# EAGLE schematic main (EAGLE 9.6.2)
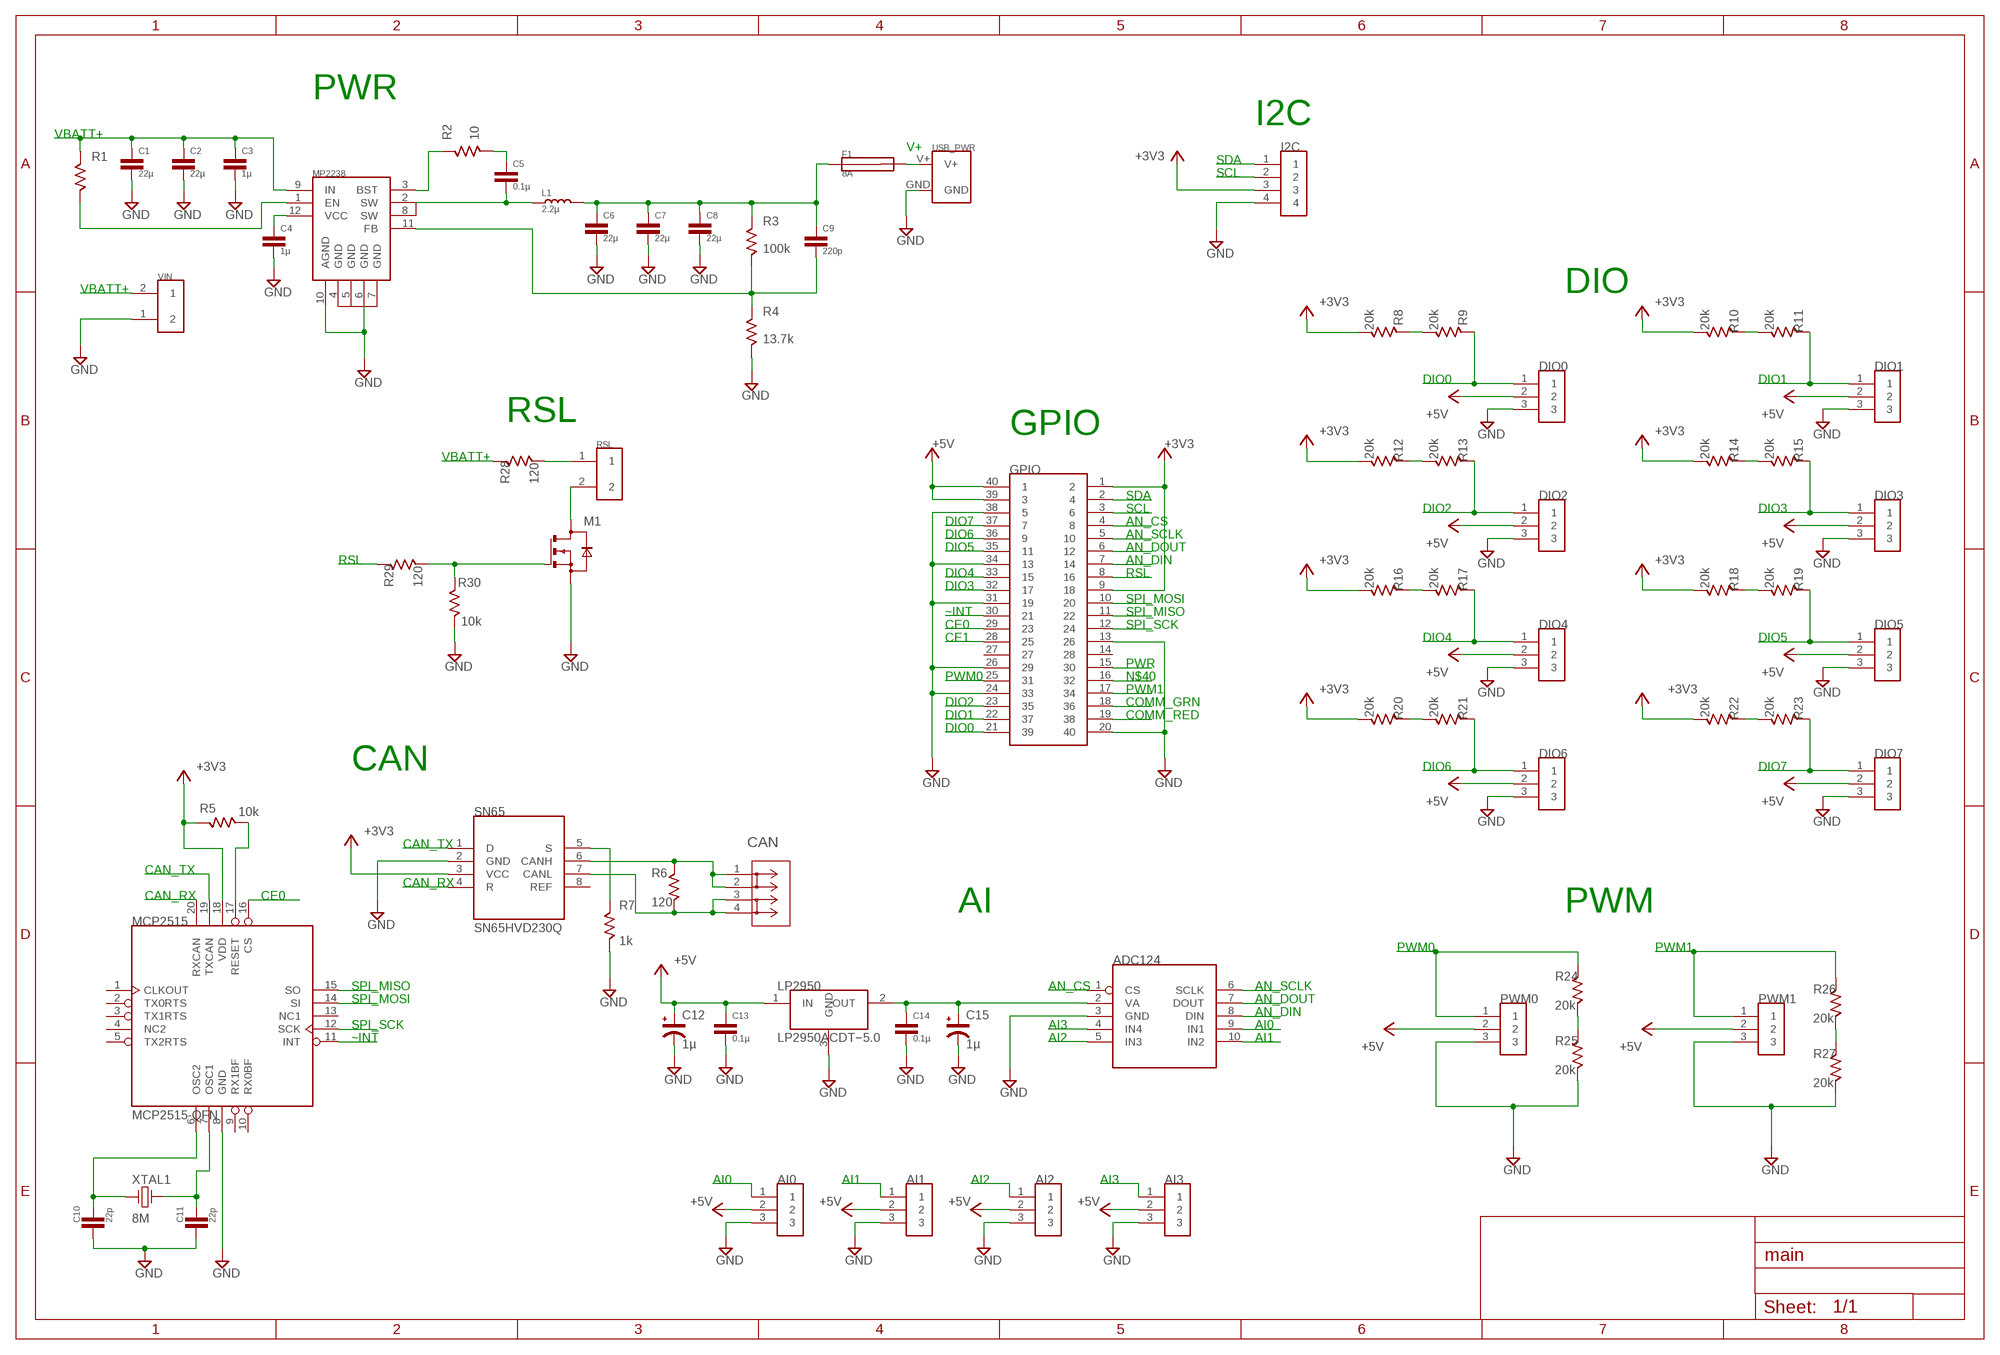
[diagram p0: schematic, sheet 1, part 1 of 2]
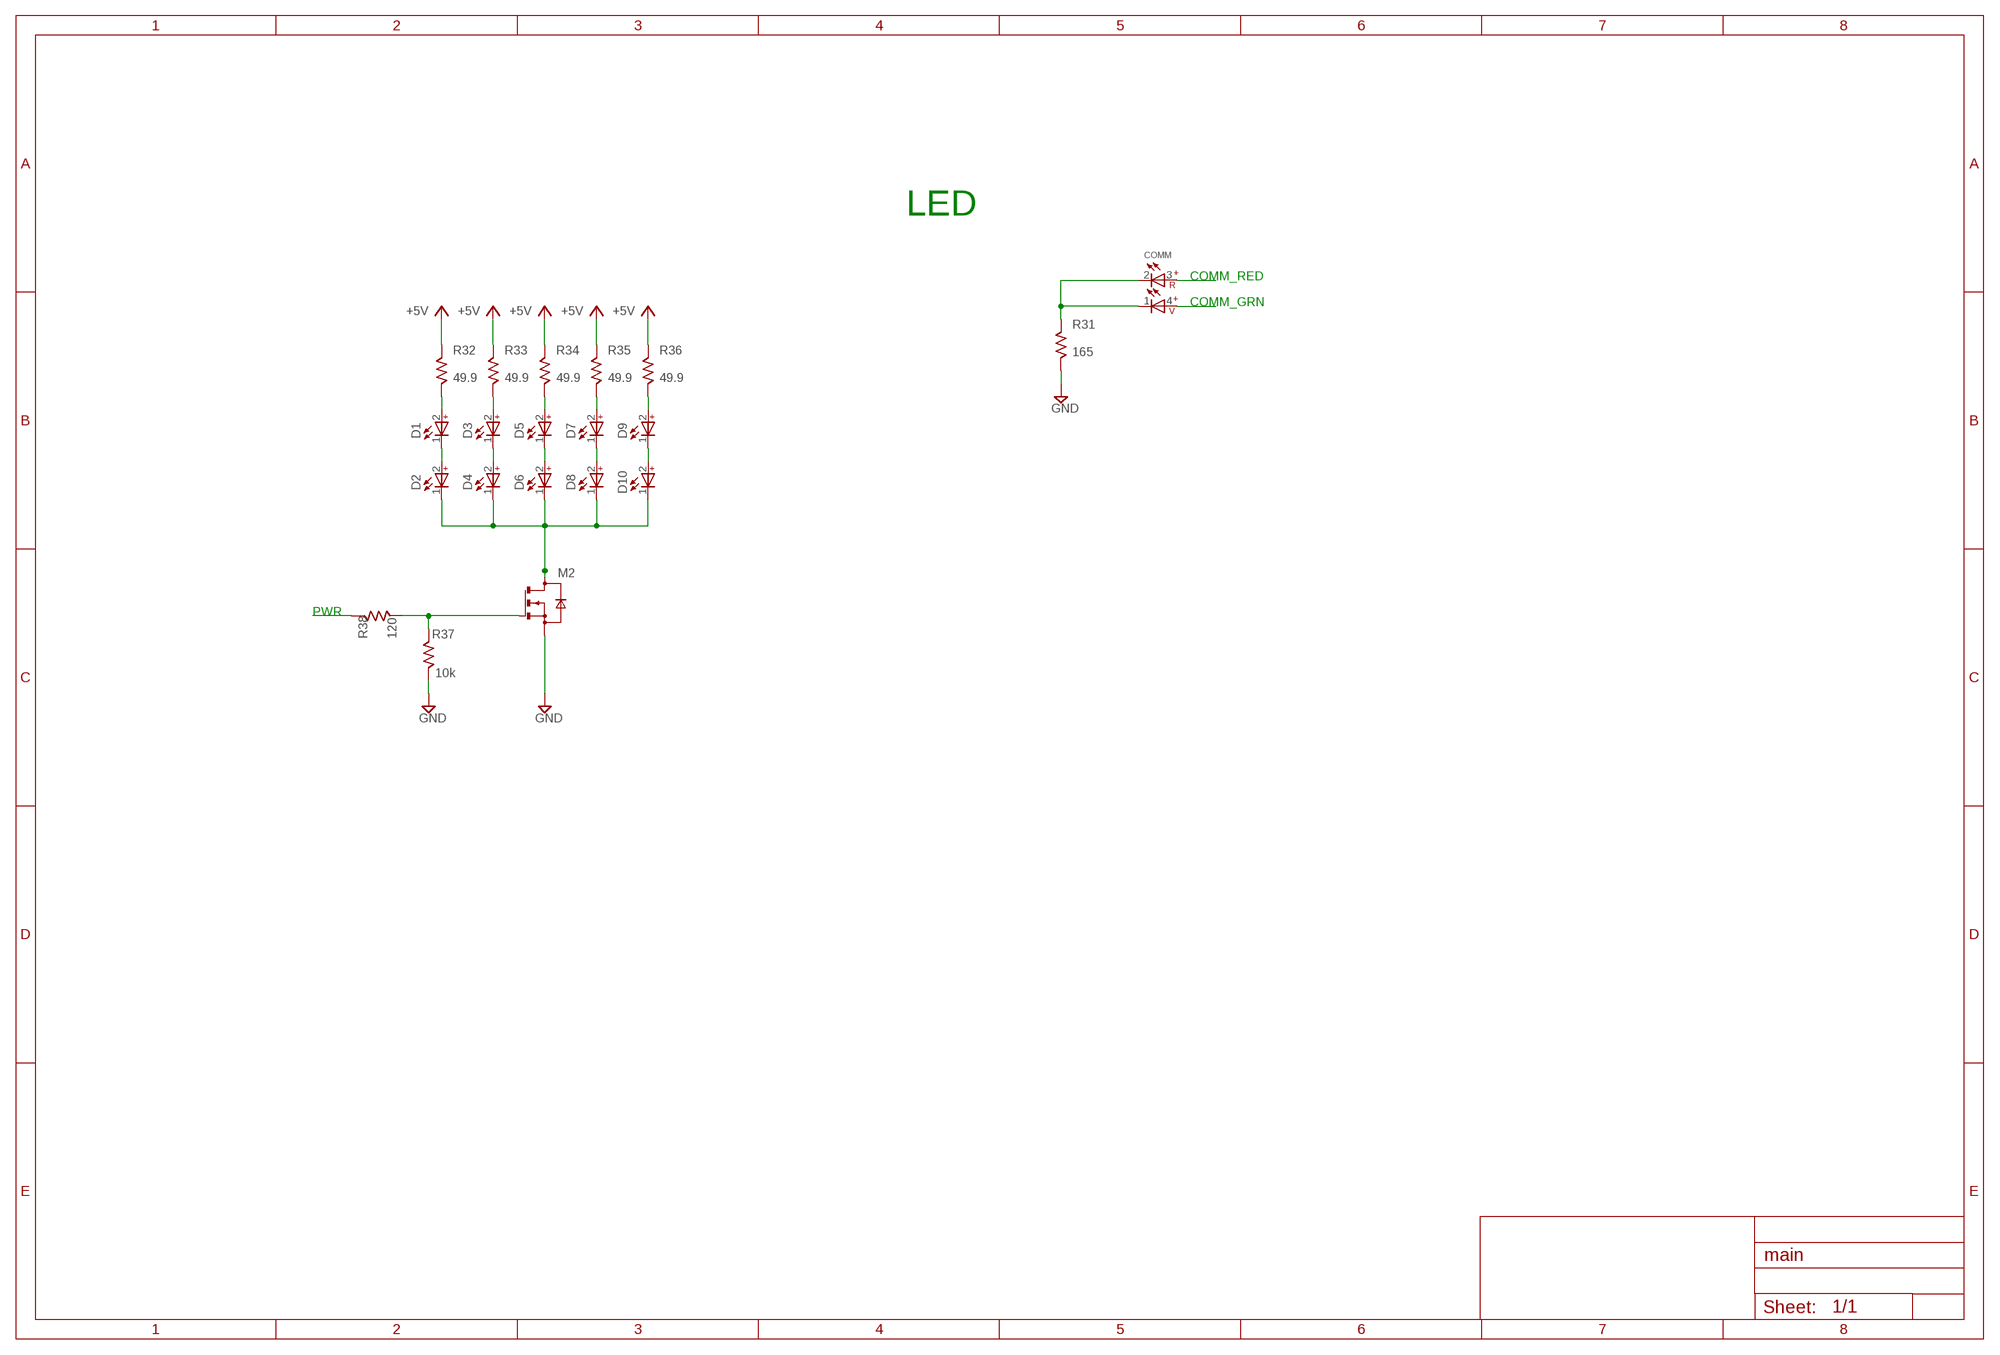
[diagram p1: schematic, sheet 1, part 2 of 2]

## Parts
ADC124  ADC124S051  [SOP50P490X110-10N]
AI0  3X1_MALE_HEADER_PIN  [HDRV3W64P254_1X3_762X254X838B]
AI1  3X1_MALE_HEADER_PIN  [HDRV3W64P254_1X3_762X254X838B]
AI2  3X1_MALE_HEADER_PIN  [HDRV3W64P254_1X3_762X254X838B]
AI3  3X1_MALE_HEADER_PIN  [HDRV3W64P254_1X3_762X254X838B]
C1  22µ  0805_CAPACITOR  [CAPC1912X140N]
C2  22µ  0805_CAPACITOR  [CAPC1912X140N]
C3  1µ  0603_CAPACITOR  [CAPC1608X90N]
C4  1µ  0603_CAPACITOR  [CAPC1608X90N]
C5  0.1µ  0603_CAPACITOR  [CAPC1608X90N]
C6  22µ  0805_CAPACITOR  [CAPC1912X140N]
C7  22µ  0805_CAPACITOR  [CAPC1912X140N]
C8  22µ  0805_CAPACITOR  [CAPC1912X140N]
C9  220p  0603_CAPACITOR  [CAPC1608X90N]
C10  22p  0402_CAPACITOR  [CAPC4020X56N]
C11  22p  0402_CAPACITOR  [CAPC4020X56N]
C12  1µ  1206_POL_TANT_CAP  [CAPMP3216X180N]
C13  0.1µ  0603_CAPACITOR  [CAPC1608X90N]
C14  0.1µ  0603_CAPACITOR  [CAPC1608X90N]
C15  1µ  1206_POL_TANT_CAP  [CAPMP3216X180N]
CAN  1870640000  [CONN_1870640000_WED]
COMM  WL-SBCC_0603_150060RV75240  [WL-SBCC_0603]
D1  WL-SMCD_0603_150060VS55040  [WL-SMCD_0603]
D2  WL-SMCD_0603_150060VS55040  [WL-SMCD_0603]
D3  WL-SMCD_0603_150060VS55040  [WL-SMCD_0603]
D4  WL-SMCD_0603_150060VS55040  [WL-SMCD_0603]
D5  WL-SMCD_0603_150060VS55040  [WL-SMCD_0603]
D6  WL-SMCD_0603_150060VS55040  [WL-SMCD_0603]
D7  WL-SMCD_0603_150060VS55040  [WL-SMCD_0603]
D8  WL-SMCD_0603_150060VS55040  [WL-SMCD_0603]
D9  WL-SMCD_0603_150060VS55040  [WL-SMCD_0603]
D10  WL-SMCD_0603_150060VS55040  [WL-SMCD_0603]
DIO0  3X1_MALE_HEADER_PIN  [HDRV3W64P254_1X3_762X254X838B]
DIO1  3X1_MALE_HEADER_PIN  [HDRV3W64P254_1X3_762X254X838B]
DIO2  3X1_MALE_HEADER_PIN  [HDRV3W64P254_1X3_762X254X838B]
DIO3  3X1_MALE_HEADER_PIN  [HDRV3W64P254_1X3_762X254X838B]
DIO4  3X1_MALE_HEADER_PIN  [HDRV3W64P254_1X3_762X254X838B]
DIO5  3X1_MALE_HEADER_PIN  [HDRV3W64P254_1X3_762X254X838B]
DIO6  3X1_MALE_HEADER_PIN  [HDRV3W64P254_1X3_762X254X838B]
DIO7  3X1_MALE_HEADER_PIN  [HDRV3W64P254_1X3_762X254X838B]
F1  8A  1206_FUSE  [FUSC3216X117N]
GPIO  2X20_FEMALE_HEADER_PINV1  [HDRVR40W64P254_2X20_5080X508X850B]
I2C  4X1_MALE_HEADER_PIN4X1_MALE_HEADER_PIN  [HDRV4W64P254_1X4_1016X254X838B]
L1  2.2µ  ECS-MPIL0630-2R2MC  [INDM7166X300N]
LP2950  LP2950ACDT−5.0  [TO229P990X238-3N]
M1  MOSFET  [SOT95P240X100-3N]
M2  MOSFET  [SOT95P240X100-3N]
MCP2515  MCP2515-QFN  [QFN50P400X400X90-21T270N]
MP2238  MP2238  [MP2238]
PWM0  3X1_MALE_HEADER_PIN  [HDRV3W64P254_1X3_762X254X838B]
PWM1  3X1_MALE_HEADER_PIN  [HDRV3W64P254_1X3_762X254X838B]
R1  0603_RESISTOR  [RESC1508X45N]
R2  10  0603_RESISTOR  [RESC1508X45N]
R3  100k  0603_RESISTOR  [RESC1508X45N]
R4  13.7k  0603_RESISTOR  [RESC1508X45N]
R5  10k  1206_RESISTOR  [RESC3116X55N]
R6  120  0603_RESISTOR  [RESC1508X45N]
R7  1k  1206_RESISTOR  [RESC3116X55N]
R8  20k  0805_RESISTOR  [RESC2012X45N]
R9  20k  0805_RESISTOR  [RESC2012X45N]
R10  20k  0805_RESISTOR  [RESC2012X45N]
R11  20k  0805_RESISTOR  [RESC2012X45N]
R12  20k  0805_RESISTOR  [RESC2012X45N]
R13  20k  0805_RESISTOR  [RESC2012X45N]
R14  20k  0805_RESISTOR  [RESC2012X45N]
R15  20k  0805_RESISTOR  [RESC2012X45N]
R16  20k  0805_RESISTOR  [RESC2012X45N]
R17  20k  0805_RESISTOR  [RESC2012X45N]
R18  20k  0805_RESISTOR  [RESC2012X45N]
R19  20k  0805_RESISTOR  [RESC2012X45N]
R20  20k  0805_RESISTOR  [RESC2012X45N]
R21  20k  0805_RESISTOR  [RESC2012X45N]
R22  20k  0805_RESISTOR  [RESC2012X45N]
R23  20k  0805_RESISTOR  [RESC2012X45N]
R24  20k  0805_RESISTOR  [RESC2012X45N]
R25  20k  0805_RESISTOR  [RESC2012X45N]
R26  20k  0805_RESISTOR  [RESC2012X45N]
R27  20k  0805_RESISTOR  [RESC2012X45N]
R28  120  0603_RESISTOR  [RESC1508X45N]
R29  120  0603_RESISTOR  [RESC1508X45N]
R30  10k  1206_RESISTOR  [RESC3116X55N]
R31  165  0805_RESISTOR  [RESC2012X45N]
R32  49.9  0603_RESISTOR  [RESC1508X45N]
R33  49.9  0603_RESISTOR  [RESC1508X45N]
R34  49.9  0603_RESISTOR  [RESC1508X45N]
R35  49.9  0603_RESISTOR  [RESC1508X45N]
R36  49.9  0603_RESISTOR  [RESC1508X45N]
R37  10k  1206_RESISTOR  [RESC3116X55N]
R38  120  0603_RESISTOR  [RESC1508X45N]
RSL  2X1_MALE_HEADER_PIN  [HDRV2W64P254_1X2_508X254X838B]
SN65  SN65HVD230Q  [SOIC127P599X175-8N]
USB_PWR  USB-C_POWER_PAD  [USB-C_POWER_PAD]
VIN  CTF020V8  [CTF020V8]
XTAL1  8M  CRYSTAL  [XTALRR488W60L1150T500H350B]

## Nets
+3V3: GPIO.1 GPIO.9 I2C.3 MCP2515.18(VDD) R5.1 R8.1 R10.1 R12.1 R14.1 R16.1 R18.1 R20.1 R22.1 SN65.3(VCC)
+5V: AI0.2 AI1.2 AI2.2 AI3.2 C12.1 C13.1(L1) DIO0.2 DIO1.2 DIO2.2 DIO3.2 DIO4.2 DIO5.2 DIO6.2 DIO7.2 GPIO.39 GPIO.40 LP2950.1(IN) PWM0.2 PWM1.2 R32.2 R33.2 R34.2 R35.2 R36.2
AI0: ADC124.9(IN1) AI0.1
AI1: ADC124.10(IN2) AI1.1
AI2: ADC124.5(IN3) AI2.1
AI3: ADC124.4(IN4) AI3.1
AN_CS: ADC124.1(CS) GPIO.4
AN_DIN: ADC124.8(DIN) GPIO.7
AN_DOUT: ADC124.7(DOUT) GPIO.6
AN_SCLK: ADC124.6(SCLK) GPIO.5
CAN_RX: MCP2515.20(RXCAN) SN65.4(R)
CAN_TX: MCP2515.19(TXCAN) SN65.1(D)
CE0: GPIO.29 MCP2515.16(CS)
CE1: GPIO.28
COMM_GRN: COMM.4(V+) GPIO.18
COMM_RED: COMM.3(R+) GPIO.19
DIO0: DIO0.1 GPIO.21 R9.2
DIO1: DIO1.1 GPIO.22 R11.2
DIO2: DIO2.1 GPIO.23 R13.2
DIO3: DIO3.1 GPIO.32 R15.2
DIO4: DIO4.1 GPIO.33 R17.2
DIO5: DIO5.1 GPIO.35 R19.2
DIO6: DIO6.1 GPIO.36 R21.2
DIO7: DIO7.1 GPIO.37 R23.2
GND: ADC124.3(GND) AI0.3 AI1.3 AI2.3 AI3.3 C1.2(L2) C2.2(L2) C3.2(L2) C4.2(L2) C6.2(L2) C7.2(L2) C8.2(L2) C10.2(L1) C11.2(L1) C12.2 C13.2(L2) C14.2(L2) C15.2 DIO0.3 DIO1.3 DIO2.3 DIO3.3 DIO4.3 DIO5.3 DIO6.3 DIO7.3 GPIO.13 GPIO.20 GPIO.24 GPIO.26 GPIO.31 GPIO.34 GPIO.38 I2C.4 LP2950.3(GND) M1.2 M2.2 MCP2515.8(GND) MP2238.6(GND) MP2238.10(AGND) PWM0.3 PWM1.3 R4.1 R7.2 R25.1 R27.1 R30.1 R31.1 R37.1 SN65.2(GND) USB_PWR.GND VIN.1
N$1: M1.3 R29.1 R30.2
N$2: C4.1(L1) MP2238.12(VCC)
N$3: MP2238.3(BST) R2.2
N$4: MP2238.1(EN) R1.1
N$5: D1.1(_) D2.2(+)
N$6: R8.2 R9.1
N$7: D1.2(+) R32.1
N$8: D3.1(_) D4.2(+)
N$9: D3.2(+) R33.1
N$10: D5.1(_) D6.2(+)
N$11: R12.2 R13.1
N$12: D5.2(+) R34.1
N$13: D7.1(_) D8.2(+)
N$14: R16.2 R17.1
N$15: R20.2 R21.1
N$16: R10.2 R11.1
N$17: R14.2 R15.1
N$18: D7.2(+) R35.1
N$19: D9.1(_) D10.2(+)
N$20: C10.1(L2) MCP2515.6(OSC2) XTAL1.1(L1)
N$21: R18.2 R19.1
N$22: D9.2(+) R36.1
N$23: M2.3 R37.2 R38.1
N$24: D2.1(_) D4.1(_) D6.1(_) D8.1(_) D10.1(_) M2.1
N$25: R22.2 R23.1
N$27: R24.1 R25.2
N$33: R26.1 R27.2
N$34: CAN.1 CAN.2 R6.2 SN65.6(CANH)
N$35: CAN.3 CAN.4 R6.1 SN65.7(CANL)
N$36: R7.1 SN65.5(S)
N$38: ADC124.2(VA) C14.1(L1) C15.1 LP2950.2(OUT)
N$40: GPIO.16
N$41: C11.1(L2) MCP2515.7(OSC1) XTAL1.2(L2)
N$45: C9.2(L2) MP2238.11(FB) R3.1 R4.2
N$47: C6.1(L1) C7.1(L1) C8.1(L1) C9.1(L1) F1.1 L1.2 R3.2
N$48: MCP2515.17(RESET) R5.2
N$49: C5.2(L2) L1.1 MP2238.2(SW)
N$50: C5.1(L1) R2.1
N$52: R28.1 RSL.1
N$53: M1.1 RSL.2
N$56: COMM.1(V-) COMM.2(R-) R31.2
PWM0: GPIO.25 PWM0.1 R24.2
PWM1: GPIO.17 PWM1.1 R26.2
PWR: GPIO.15 R38.2
RSL: GPIO.8 R29.2
SCL: GPIO.3 I2C.2
SDA: GPIO.2 I2C.1
SPI_MISO: GPIO.11 MCP2515.15(SO)
SPI_MOSI: GPIO.10 MCP2515.14(SI)
SPI_SCK: GPIO.12 MCP2515.12(SCK)
V+: F1.2 USB_PWR.V+
VBATT+: C1.1(L1) C2.1(L1) C3.1(L1) MP2238.9(IN) R1.2 R28.2 VIN.2
~INT: GPIO.30 MCP2515.11(INT)
Unconnected: GPIO.14 GPIO.27 MCP2515.1(CLKOUT) MCP2515.2(TX0RTS) MCP2515.3(TX1RTS) MCP2515.4(NC2) MCP2515.5(TX2RTS) MCP2515.9(RX1BF) MCP2515.10(RX0BF) MCP2515.13(NC1) MP2238.4(GND) MP2238.5(GND) MP2238.7(GND) MP2238.8(SW) SN65.8(REF)

## Notes on the sheet
- PWR
- I2C
- LED
- DIO
- RSL
- GPIO
- CAN
- AI | PWM

## Library data of the parts
ADC124 = SamuelLibrary:ADC124S051
AI0 AI1-AI3 DIO0 DIO1-DIO7 PWM0 PWM1 = SamuelLibrary:3X1_MALE_HEADER_PIN
C1 C2 C6-C8 = SamuelLibrary:0805_CAPACITOR
C3-C5 C9 C13 C14 = SamuelLibrary:0603_CAPACITOR
C10 C11 = SamuelLibrary:0402_CAPACITOR
C12 C15 = SamuelLibrary:1206_POL_TANT_CAP
CAN = SamuelLibrary:1870640000; BUILT_BY: EMA_Colton; COPYRIGHT: Copyright (C) 2018 Accelerated Designs. All rights reserved; MANUFACTURER_PART_NUMBER: 1870640000; SOURCELIBRARY: Weidmuller_2019-05-22; VENDOR: Weidmuller
COMM = SamuelLibrary:WL-SBCC_0603: WL-SBCC SMT Bi-color Chip LED Compact Characteristics Two chips in one packaging Small size Industry standard footprint High efficiency Low power consumption Wide viewing angle Small package for exceptional brightness Packaged in standard tape and reel 7" Applications Backlighting applications Status indicator Front panel indicators Push button backlighting Symbol and switch backlighting <https://www.we-online.com/catalog/media/o136122v209%20Family_WC-SBCC.jpg> Details see: https://www.we-online.com/catalog/en/WL-SBCC/ Created by Yingchun, Shan 2020-03-18 2020(C) Wurth Elektronik; ABSTRAHLWINKEL: 140°; CHIP-TECHNOLOGY: AlInGaP; DATASHEET-URL: https://www.we-online.com/catalog/datasheet/150060RV75240.pdf; EMITTING-COLOR: Red & Bright Green; I-V-R-TYP: 230mcd; I-V-V-TYP: 90mcd; LAMDA-DOM-R-TYP: 625nm; LAMDA-DOM-V-TYP: 570nm; LAMDA-PEAK-R-TYP: 630nm; LAMDA-PEAK-V-TYP: 572nm; PART-NUMBER: 150060RV75240; V-F-R-TYP: 2V; V-F-V-TYP: 2V
D1-D10 = SamuelLibrary:WL-SMCD_0603: WL-SMCD SMT Mono-color Chip LED Diffused Characteristics Industrial 0603 platform – 1.6 x 0.8 mm Wide viewing angle 140° Thin version: 0.4 mm Applications Office Automation Home appliances Industrial equipment Front panel backlighting Button backlighting LCD backlighting Navigation backlighting <https://www.we-online.com/catalog/media/o121399v209%20Family_WL-SMCD_0603_thin_0,4mm_150060xx55040.jpg> Details see: https://www.we-online.com/catalog/en/WL-SMCD/ Updated By Yingchun Shan 2020-03-18 2020 (C) Wurth Elektronik; ABSTRAHLWINKEL: 140°; CHIP-TECHNOLOGY: AlInGaP; DATASHEET-URL: https://www.we-online.com/catalog/datasheet/150060VS55040.pdf; EMITTING-COLOR: Bright Green; I-V-TYP: 60mcd; LAMDA-DOM-TYP: 573nm; LAMDA-PEAK-TYP: 575nm; PART-NUMBER: 150060VS55040; V-F-TYP: 2V
F1 = SamuelLibrary:1206_FUSE
GPIO = SamuelLibrary:2X20_FEMALE_HEADER_PIN
I2C = SamuelLibrary:4X1_MALE_HEADER_PIN
L1 = SamuelLibrary:ECS-MPIL0630-2R2MC
LP2950 = SamuelLibrary:LP2950ACDT−5.0
M1 M2 = SamuelLibrary:MOSFET
MCP2515 = SamuelLibrary:MCP2515-QFN
MP2238 = SamuelLibrary:MP2238
R1-R4 R6 R28 R29 R32-R36 R38 = SamuelLibrary:0603_RESISTOR
R5 R7 R30 R37 = SamuelLibrary:1206_RESISTOR
R8-R27 R31 = SamuelLibrary:0805_RESISTOR
RSL = SamuelLibrary:2X1_MALE_HEADER_PIN
SN65 = SamuelLibrary:SN65HVD230Q
USB_PWR = SamuelLibrary:USB-C_POWER_PAD
VIN = SamuelLibrary:CTF020V8
XTAL1 = SamuelLibrary:CRYSTAL

## Module PWR
Ports: 

### Library data of the parts

## Module CAN
Ports: 

### Library data of the parts

## Module PI
Ports: 

### Library data of the parts

## Module LEDS
Ports: 

### Library data of the parts

## Module ADC
Ports: 

### Library data of the parts